# EAGLE schematic HighRangeAccelerometer (EAGLE 6.3)
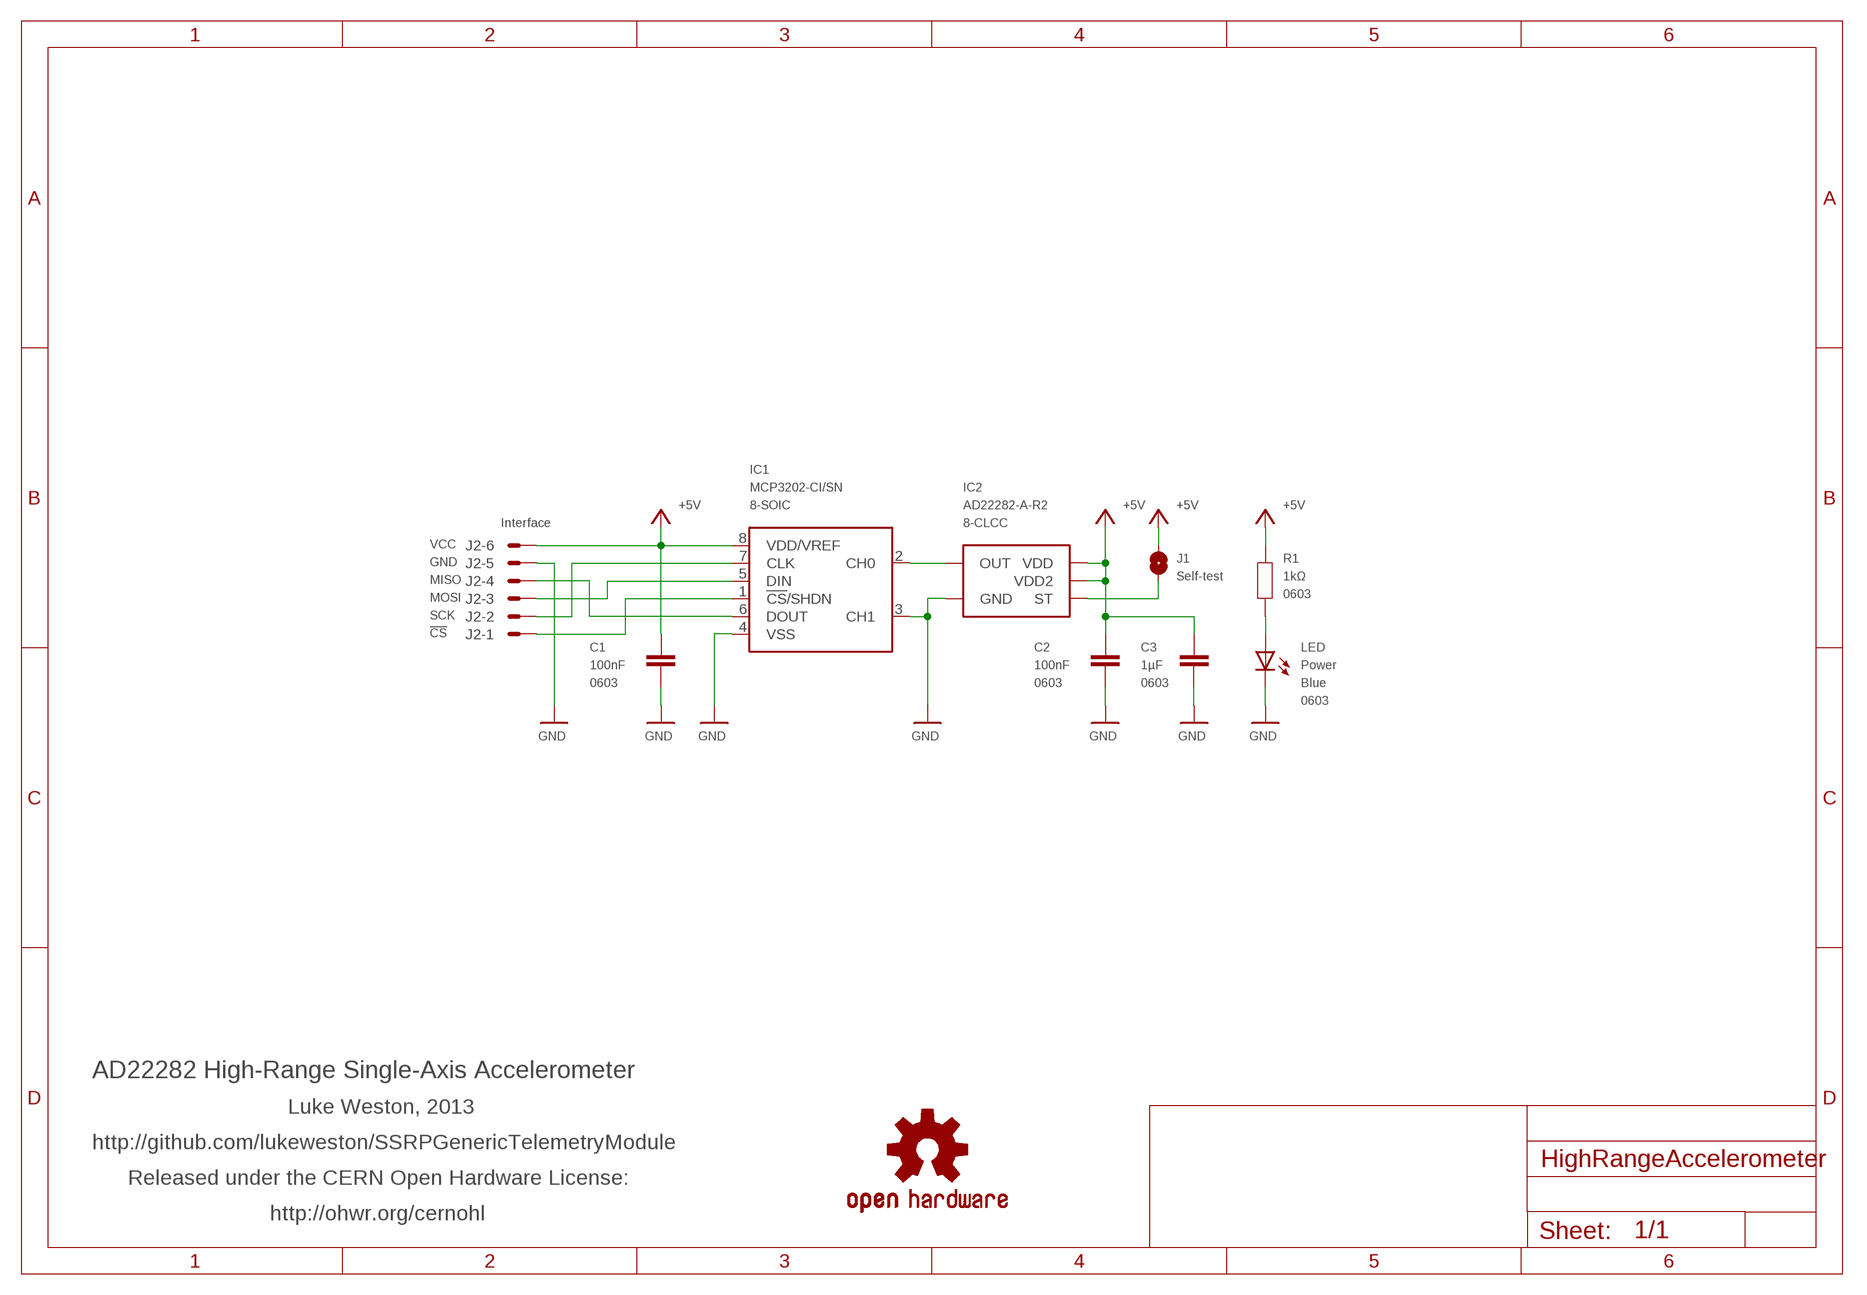
[diagram p0: schematic, sheet 1]

## Parts
C1  100nF  CAP0603  [0603]
C2  100nF  CAP0603  [0603]
C3  1µF  CAP0603  [0603]
IC1  MCP3202-CI/SN  MCP3202SN  [SO-08]
IC2  AD22282-A-R2  ADXL193  [ADXL193]
J1  Self-test  SJ  [SJ]
J2  Interface  22-23-2061  [22-23-2061]
LED  Power  LED0603  [LED-0603]
R1  1kΩ  RESISTOR0603  [0603]
SY  OSHW-LOGOS  [OSHW-LOGO-S]

## Nets
+5V: C1.2 C2.2 C3.2 IC1.8(VDD/VREF) IC2.P$7(VDD) IC2.P$8(VDD2) J1.2 J2.6 R1.2
GND: C1.1 C2.1 C3.1 IC1.3(CH1) IC1.4(VSS) IC2.P$3(GND) J2.5 LED.C
N$11: IC1.2(CH0) IC2.P$6(OUT)
N$12: LED.A R1.1
N$18: IC1.6(DOUT) J2.4
N$21: IC1.5(DIN) J2.3
N$22: IC1.7(CLK) J2.2
N$23: IC1.1(!CS!/SHDN) J2.1
N$25: IC2.P$4(ST) J1.1

## Notes on the sheet
- VCC
- GND
- MISO
- MOSI
- SCK
- !CS
- AD22282 High-Range Single-Axis Accelerometer
- Luke Weston, 2013
- http://github.com/lukeweston/SSRPGenericTelemetryModule
- Released under the CERN Open Hardware License:
- http://ohwr.org/cernohl

## Library data of the parts
C1-C3 = freetronics-master-v1:CAP: Capacitor Standard 0603 ceramic capacitor, and 0.1" leaded capacitor.; PACKAGE: 0603
IC1 = microchip-update:MCP3202: 2.7V Dual Channel 12-Bit A/D Converter with SPI Serial Interface Source: http://ww1.microchip.com/downloads/en/DeviceDoc/21034D.pdf; PACKAGE: 8-SOIC
IC2 = SparkFun:ADXL193: 250g accelerometer analog out; PACKAGE: 8-CLCC
J1 = jumper:SJ: SMD solder JUMPER
J2 = con-molex:22-23-2061: .100" (2.54mm) Center Header - 6 Pin; MF: MOLEX; MPN: 22-23-2061; OC_FARNELL: 1462922; OC_NEWARK: 27C1933
LED = freetronics-master-v1:LED: LEDs Standard schematic elements and footprints for 5mm, 3mm, 1206, and 0603 sized LEDs. 5mm - Spark Fun Electronics SKU : COM-00529 (and others); COLOUR: Blue; PACKAGE: 0603
R1 = freetronics-master-v1:RESISTOR: Resistor Basic schematic elements and footprints for 0603, 1206, and PTH 1/10th watt (small) resistors.; PACKAGE: 0603
SY = SparkFun:OSHW-LOGO: Open Source Hardware Logo This logo indicates the piece of hardware it is found on incorporates a OSHW license and/or adheres to the definition of open source hardware found here: http://freedomdefined.org/OSHW